# Altium schematic sheet 20key.SchDoc
size A1
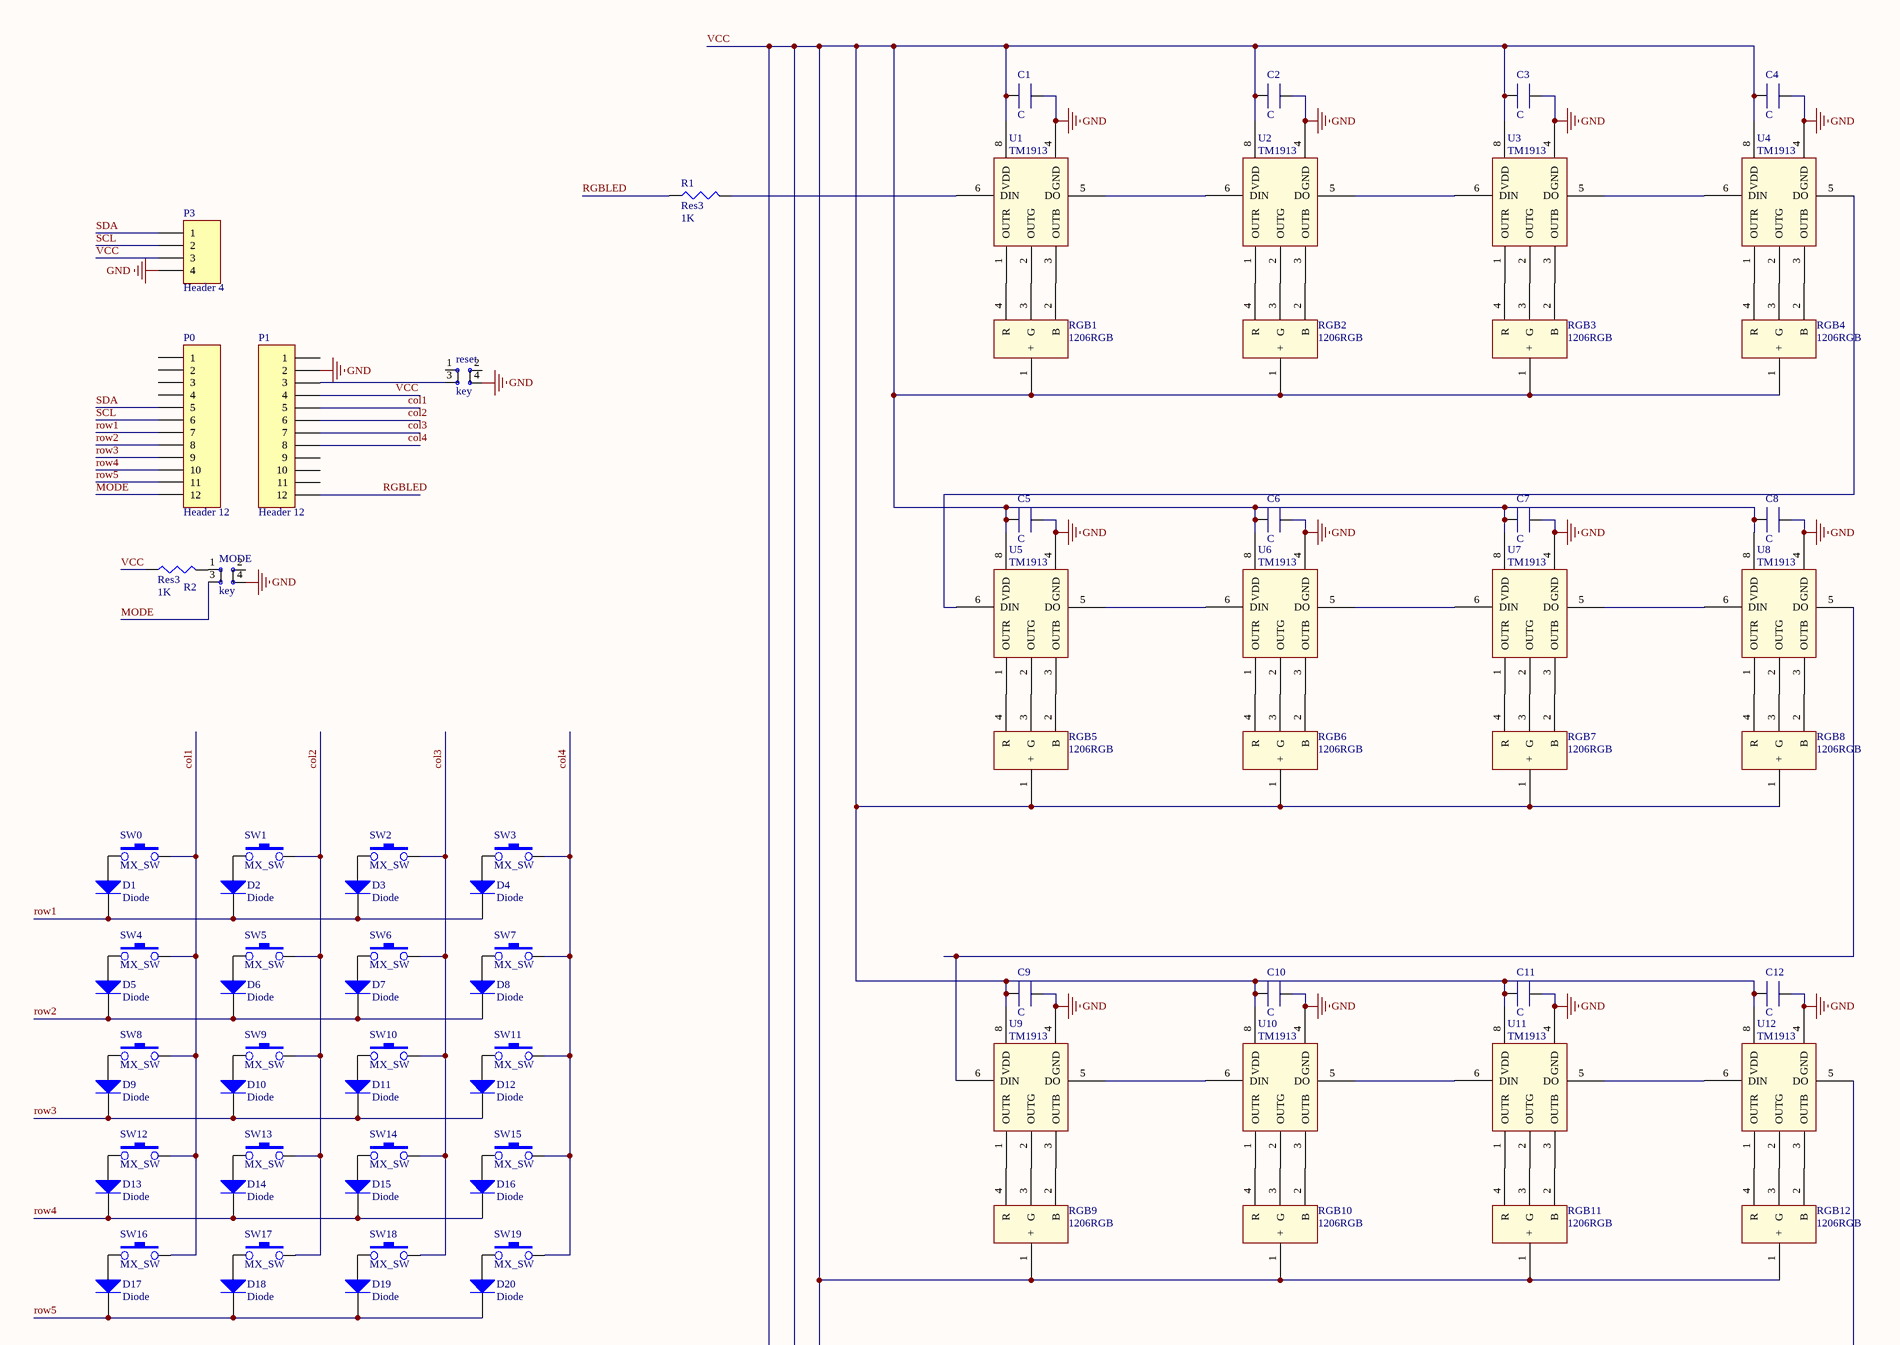
[diagram p0: 20key.SchDoc, top]
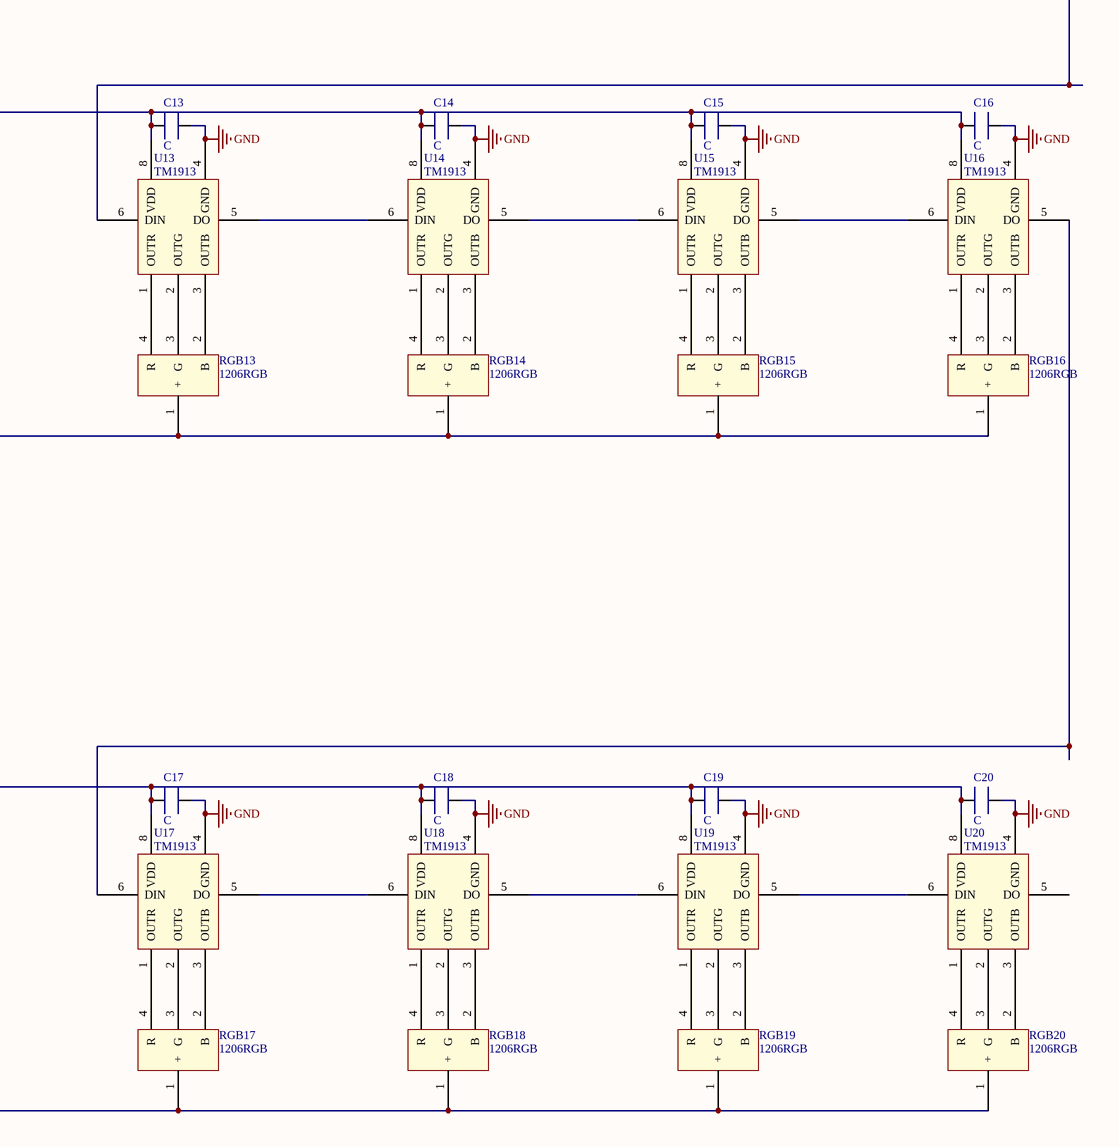
[diagram p1: 20key.SchDoc, bottom]

## Parts
C1  C  [PCBComponent_1]
C2  C  [PCBComponent_1]
C3  C  [PCBComponent_1]
C4  C  [PCBComponent_1]
C5  C  [PCBComponent_1]
C6  C  [PCBComponent_1]
C7  C  [PCBComponent_1]
C8  C  [PCBComponent_1]
C9  C  [PCBComponent_1]
C10  C  [PCBComponent_1]
C11  C  [PCBComponent_1]
C12  C  [PCBComponent_1]
C13  C  [PCBComponent_1]
C14  C  [PCBComponent_1]
C15  C  [PCBComponent_1]
C16  C  [PCBComponent_1]
C17  C  [PCBComponent_1]
C18  C  [PCBComponent_1]
C19  C  [PCBComponent_1]
C20  C  [PCBComponent_1]
D1  Diode  [SODFL160X77-2M]
D2  Diode  [SODFL160X77-2M]
D3  Diode  [SODFL160X77-2M]
D4  Diode  [SODFL160X77-2M]
D5  Diode  [SODFL160X77-2M]
D6  Diode  [SODFL160X77-2M]
D7  Diode  [SODFL160X77-2M]
D8  Diode  [SODFL160X77-2M]
D9  Diode  [SODFL160X77-2M]
D10  Diode  [SODFL160X77-2M]
D11  Diode  [SODFL160X77-2M]
D12  Diode  [SODFL160X77-2M]
D13  Diode  [SODFL160X77-2M]
D14  Diode  [SODFL160X77-2M]
D15  Diode  [SODFL160X77-2M]
D16  Diode  [SODFL160X77-2M]
D17  Diode  [SODFL160X77-2M]
D18  Diode  [SODFL160X77-2M]
D19  Diode  [SODFL160X77-2M]
D20  Diode  [SODFL160X77-2M]
MODE  key  [PCBComponent_1]
P0  Header 12  [HDR1X12]
P1  Header 12  [HDR1X12]
P3  Header 4  [HDR1X4]
R1  Res3  value 1K  [J1-0603]
R2  Res3  value 1K  [J1-0603]
reset  key  [PCBComponent_1]
RGB1  1206RGB  [CAC-150P150X300-4M]
RGB2  1206RGB  [CAC-150P150X300-4M]
RGB3  1206RGB  [CAC-150P150X300-4M]
RGB4  1206RGB  [CAC-150P150X300-4M]
RGB5  1206RGB  [CAC-150P150X300-4M]
RGB6  1206RGB  [CAC-150P150X300-4M]
RGB7  1206RGB  [CAC-150P150X300-4M]
RGB8  1206RGB  [CAC-150P150X300-4M]
RGB9  1206RGB  [CAC-150P150X300-4M]
RGB10  1206RGB  [CAC-150P150X300-4M]
RGB11  1206RGB  [CAC-150P150X300-4M]
RGB12  1206RGB  [CAC-150P150X300-4M]
RGB13  1206RGB  [CAC-150P150X300-4M]
RGB14  1206RGB  [CAC-150P150X300-4M]
RGB15  1206RGB  [CAC-150P150X300-4M]
RGB16  1206RGB  [CAC-150P150X300-4M]
RGB17  1206RGB  [CAC-150P150X300-4M]
RGB18  1206RGB  [CAC-150P150X300-4M]
RGB19  1206RGB  [CAC-150P150X300-4M]
RGB20  1206RGB  [CAC-150P150X300-4M]
SW0  MX_SW  [MX_SW-4]
SW1  MX_SW  [MX_SW-4]
SW2  MX_SW  [MX_SW-4]
SW3  MX_SW  [MX_SW-4]
SW4  MX_SW  [MX_SW-4]
SW5  MX_SW  [MX_SW-4]
SW6  MX_SW  [MX_SW-4]
SW7  MX_SW  [MX_SW-4]
SW8  MX_SW  [MX_SW-4]
SW9  MX_SW  [MX_SW-4]
SW10  MX_SW  [MX_SW-4]
SW11  MX_SW  [MX_SW-4]
SW12  MX_SW  [MX_SW-4]
SW13  MX_SW  [MX_SW-4]
SW14  MX_SW  [MX_SW-4]
SW15  MX_SW  [MX_SW-4]
SW16  MX_SW  [MX_SW-4]
SW17  MX_SW  [MX_SW-4]
SW18  MX_SW  [MX_SW-4]
SW19  MX_SW  [MX_SW-4]
U1  TM1913  [SOP127P600X175-8L]
U2  TM1913  [SOP127P600X175-8L]
U3  TM1913  [SOP127P600X175-8L]
U4  TM1913  [SOP127P600X175-8L]
U5  TM1913  [SOP127P600X175-8L]
U6  TM1913  [SOP127P600X175-8L]
U7  TM1913  [SOP127P600X175-8L]
U8  TM1913  [SOP127P600X175-8L]
U9  TM1913  [SOP127P600X175-8L]
U10  TM1913  [SOP127P600X175-8L]
U11  TM1913  [SOP127P600X175-8L]
U12  TM1913  [SOP127P600X175-8L]
U13  TM1913  [SOP127P600X175-8L]
U14  TM1913  [SOP127P600X175-8L]
U15  TM1913  [SOP127P600X175-8L]
U16  TM1913  [SOP127P600X175-8L]
U17  TM1913  [SOP127P600X175-8L]
U18  TM1913  [SOP127P600X175-8L]
U19  TM1913  [SOP127P600X175-8L]
U20  TM1913  [SOP127P600X175-8L]

## Nets
GND: C1.2 C2.2 C3.2 C4.2 C5.2 C6.2 C7.2 C8.2 C9.2 C10.2 C11.2 C12.2 C13.2 C14.2 C15.2 C16.2 C17.2 C18.2 C19.2 C20.2 MODE.4(B) P1.2 P3.4 reset.4(B) U1.4(GND) U2.4(GND) U3.4(GND) U4.4(GND) U5.4(GND) U6.4(GND) U7.4(GND) U8.4(GND) U9.4(GND) U10.4(GND) U11.4(GND) U12.4(GND) U13.4(GND) U14.4(GND) U15.4(GND) U16.4(GND) U17.4(GND) U18.4(GND) U19.4(GND) U20.4(GND)
col1: P1.5 SW0.2 SW4.2 SW8.2 SW12.2 SW16.2
col2: P1.6 SW1.2 SW5.2 SW9.2 SW13.2 SW17.2
col3: P1.7 SW2.2 SW6.2 SW10.2 SW14.2 SW18.2
col4: P1.8 SW3.2 SW7.2 SW11.2 SW15.2 SW19.2
MODE: MODE.3(A) P0.12
RGBLED: P1.12 R1.1
row1: D1.1(K) D2.1(K) D3.1(K) D4.1(K) P0.7
row2: D5.1(K) D6.1(K) D7.1(K) D8.1(K) P0.8
row3: D9.1(K) D10.1(K) D11.1(K) D12.1(K) P0.9
row4: D13.1(K) D14.1(K) D15.1(K) D16.1(K) P0.10
row5: D17.1(K) D18.1(K) D19.1(K) D20.1(K) P0.11
SCL: P0.6 P3.2
SDA: P0.5 P3.1
VCC: C1.1 C2.1 C3.1 C4.1 C5.1 C6.1 C7.1 C8.1 C9.1 C10.1 C11.1 C12.1 C13.1 C14.1 C15.1 C16.1 C17.1 C18.1 C19.1 C20.1 P1.4 P3.3 R2.1 RGB1.1(+) RGB2.1(+) RGB3.1(+) RGB4.1(+) RGB5.1(+) RGB6.1(+) RGB7.1(+) RGB8.1(+) RGB9.1(+) RGB10.1(+) RGB11.1(+) RGB12.1(+) RGB13.1(+) RGB14.1(+) RGB15.1(+) RGB16.1(+) RGB17.1(+) RGB18.1(+) RGB19.1(+) RGB20.1(+) U1.8(VDD) U2.8(VDD) U3.8(VDD) U4.8(VDD) U5.8(VDD) U6.8(VDD) U7.8(VDD) U8.8(VDD) U9.8(VDD) U10.8(VDD) U11.8(VDD) U12.8(VDD) U13.8(VDD) U14.8(VDD) U15.8(VDD) U16.8(VDD) U17.8(VDD) U18.8(VDD) U19.8(VDD) U20.8(VDD)
NetD1_2: D1.2(A) SW0.1
NetD2_2: D2.2(A) SW1.1
NetD3_2: D3.2(A) SW2.1
NetD4_2: D4.2(A) SW3.1
NetD5_2: D5.2(A) SW4.1
NetD6_2: D6.2(A) SW5.1
NetD7_2: D7.2(A) SW6.1
NetD8_2: D8.2(A) SW7.1
NetD9_2: D9.2(A) SW8.1
NetD10_2: D10.2(A) SW9.1
NetD11_2: D11.2(A) SW10.1
NetD12_2: D12.2(A) SW11.1
NetD13_2: D13.2(A) SW12.1
NetD14_2: D14.2(A) SW13.1
NetD15_2: D15.2(A) SW14.1
NetD16_2: D16.2(A) SW15.1
NetD17_2: D17.2(A) SW16.1
NetD18_2: D18.2(A) SW17.1
NetD19_2: D19.2(A) SW18.1
NetD20_2: D20.2(A) SW19.1
NetMODE_1: MODE.1(A) R2.2
NetP1_3: P1.3 reset.3(A)
NetR1_2: R1.2 U1.6(DIN)
NetRGB1_2: RGB1.2(B) U1.3(OUTB)
NetRGB1_3: RGB1.3(G) U1.2(OUTG)
NetRGB1_4: RGB1.4(R) U1.1(OUTR)
NetRGB2_2: RGB2.2(B) U2.3(OUTB)
NetRGB2_3: RGB2.3(G) U2.2(OUTG)
NetRGB2_4: RGB2.4(R) U2.1(OUTR)
NetRGB3_2: RGB3.2(B) U3.3(OUTB)
NetRGB3_3: RGB3.3(G) U3.2(OUTG)
NetRGB3_4: RGB3.4(R) U3.1(OUTR)
NetRGB4_2: RGB4.2(B) U4.3(OUTB)
NetRGB4_3: RGB4.3(G) U4.2(OUTG)
NetRGB4_4: RGB4.4(R) U4.1(OUTR)
NetRGB5_2: RGB5.2(B) U5.3(OUTB)
NetRGB5_3: RGB5.3(G) U5.2(OUTG)
NetRGB5_4: RGB5.4(R) U5.1(OUTR)
NetRGB6_2: RGB6.2(B) U6.3(OUTB)
NetRGB6_3: RGB6.3(G) U6.2(OUTG)
NetRGB6_4: RGB6.4(R) U6.1(OUTR)
NetRGB7_2: RGB7.2(B) U7.3(OUTB)
NetRGB7_3: RGB7.3(G) U7.2(OUTG)
NetRGB7_4: RGB7.4(R) U7.1(OUTR)
NetRGB8_2: RGB8.2(B) U8.3(OUTB)
NetRGB8_3: RGB8.3(G) U8.2(OUTG)
NetRGB8_4: RGB8.4(R) U8.1(OUTR)
NetRGB9_2: RGB9.2(B) U9.3(OUTB)
NetRGB9_3: RGB9.3(G) U9.2(OUTG)
NetRGB9_4: RGB9.4(R) U9.1(OUTR)
NetRGB10_2: RGB10.2(B) U10.3(OUTB)
NetRGB10_3: RGB10.3(G) U10.2(OUTG)
NetRGB10_4: RGB10.4(R) U10.1(OUTR)
NetRGB11_2: RGB11.2(B) U11.3(OUTB)
NetRGB11_3: RGB11.3(G) U11.2(OUTG)
NetRGB11_4: RGB11.4(R) U11.1(OUTR)
NetRGB12_2: RGB12.2(B) U12.3(OUTB)
NetRGB12_3: RGB12.3(G) U12.2(OUTG)
NetRGB12_4: RGB12.4(R) U12.1(OUTR)
NetRGB13_2: RGB13.2(B) U13.3(OUTB)
NetRGB13_3: RGB13.3(G) U13.2(OUTG)
NetRGB13_4: RGB13.4(R) U13.1(OUTR)
NetRGB14_2: RGB14.2(B) U14.3(OUTB)
NetRGB14_3: RGB14.3(G) U14.2(OUTG)
NetRGB14_4: RGB14.4(R) U14.1(OUTR)
NetRGB15_2: RGB15.2(B) U15.3(OUTB)
NetRGB15_3: RGB15.3(G) U15.2(OUTG)
NetRGB15_4: RGB15.4(R) U15.1(OUTR)
NetRGB16_2: RGB16.2(B) U16.3(OUTB)
NetRGB16_3: RGB16.3(G) U16.2(OUTG)
NetRGB16_4: RGB16.4(R) U16.1(OUTR)
NetRGB17_2: RGB17.2(B) U17.3(OUTB)
NetRGB17_3: RGB17.3(G) U17.2(OUTG)
NetRGB17_4: RGB17.4(R) U17.1(OUTR)
NetRGB18_2: RGB18.2(B) U18.3(OUTB)
NetRGB18_3: RGB18.3(G) U18.2(OUTG)
NetRGB18_4: RGB18.4(R) U18.1(OUTR)
NetRGB19_2: RGB19.2(B) U19.3(OUTB)
NetRGB19_3: RGB19.3(G) U19.2(OUTG)
NetRGB19_4: RGB19.4(R) U19.1(OUTR)
NetRGB20_2: RGB20.2(B) U20.3(OUTB)
NetRGB20_3: RGB20.3(G) U20.2(OUTG)
NetRGB20_4: RGB20.4(R) U20.1(OUTR)
NetU1_5: U1.5(DO) U2.6(DIN)
NetU2_5: U2.5(DO) U3.6(DIN)
NetU3_5: U3.5(DO) U4.6(DIN)
NetU4_5: U4.5(DO) U5.6(DIN)
NetU5_5: U5.5(DO) U6.6(DIN)
NetU6_5: U6.5(DO) U7.6(DIN)
NetU7_5: U7.5(DO) U8.6(DIN)
NetU8_5: U8.5(DO) U9.6(DIN)
NetU9_5: U9.5(DO) U10.6(DIN)
NetU10_5: U10.5(DO) U11.6(DIN)
NetU11_5: U11.5(DO) U12.6(DIN)
NetU12_5: U12.5(DO) U13.6(DIN)
NetU13_5: U13.5(DO) U14.6(DIN)
NetU14_5: U14.5(DO) U15.6(DIN)
NetU15_5: U15.5(DO) U16.6(DIN)
NetU16_5: U16.5(DO) U17.6(DIN)
NetU17_5: U17.5(DO) U18.6(DIN)
NetU18_5: U18.5(DO) U19.6(DIN)
NetU19_5: U19.5(DO) U20.6(DIN)

Not connected (* = marked no-connect by the designer): MODE 2(B); P0 1 2 3 4; P1 1 9 10 11; reset 1(A) 2(B); U20 5(DO)

## Library data of the parts
C1-C20 = C: C: C*; value: 100nF
D1-D20 = Diode_1: Default Diode; Published: 8-Jun-2000; LatestRevisionDate: 17-Jul-2002; LatestRevisionNote: Re-released for DXP Platform.; PackageVersion: Sep-1996; PackageReference: SMC; Publisher: Altium Limited; PackageDescription: DO-214-AB/SMC; 2 C-Bend Leads; Body 7.9 x 5.9 mm, inc. leads (LxW); Code_JEDEC: DO-214-AB
P0 P1 = Header 12: Header, 12-Pin; LatestRevisionDate: 17-Jul-2002; LatestRevisionNote: Re-released for DXP Platform.; Publisher: Altium Limited
P3 = Header 4: Header, 4-Pin; LatestRevisionDate: 17-Jul-2002; LatestRevisionNote: Re-released for DXP Platform.; Publisher: Altium Limited
R1 R2 = Res3: Resistor; Published: 8-Jun-2000; LatestRevisionDate: 29-May-2009; LatestRevisionNote: IPC-7351 Footprint Added.; PackageReference: J1-0603; Publisher: Altium Limited; PackageDescription: Chip Resistor
SW0-SW19 = MX_SW-4: with Fixation pins  1-Pole